# EasyEDA schematic SCH_LED stick_2021-12-25.json
TITLE: Sheet_1; REV: 1.0; Date: 2021-12-22; Sheet: 1/1; Drawn By: limchengwei; Company: Your Company
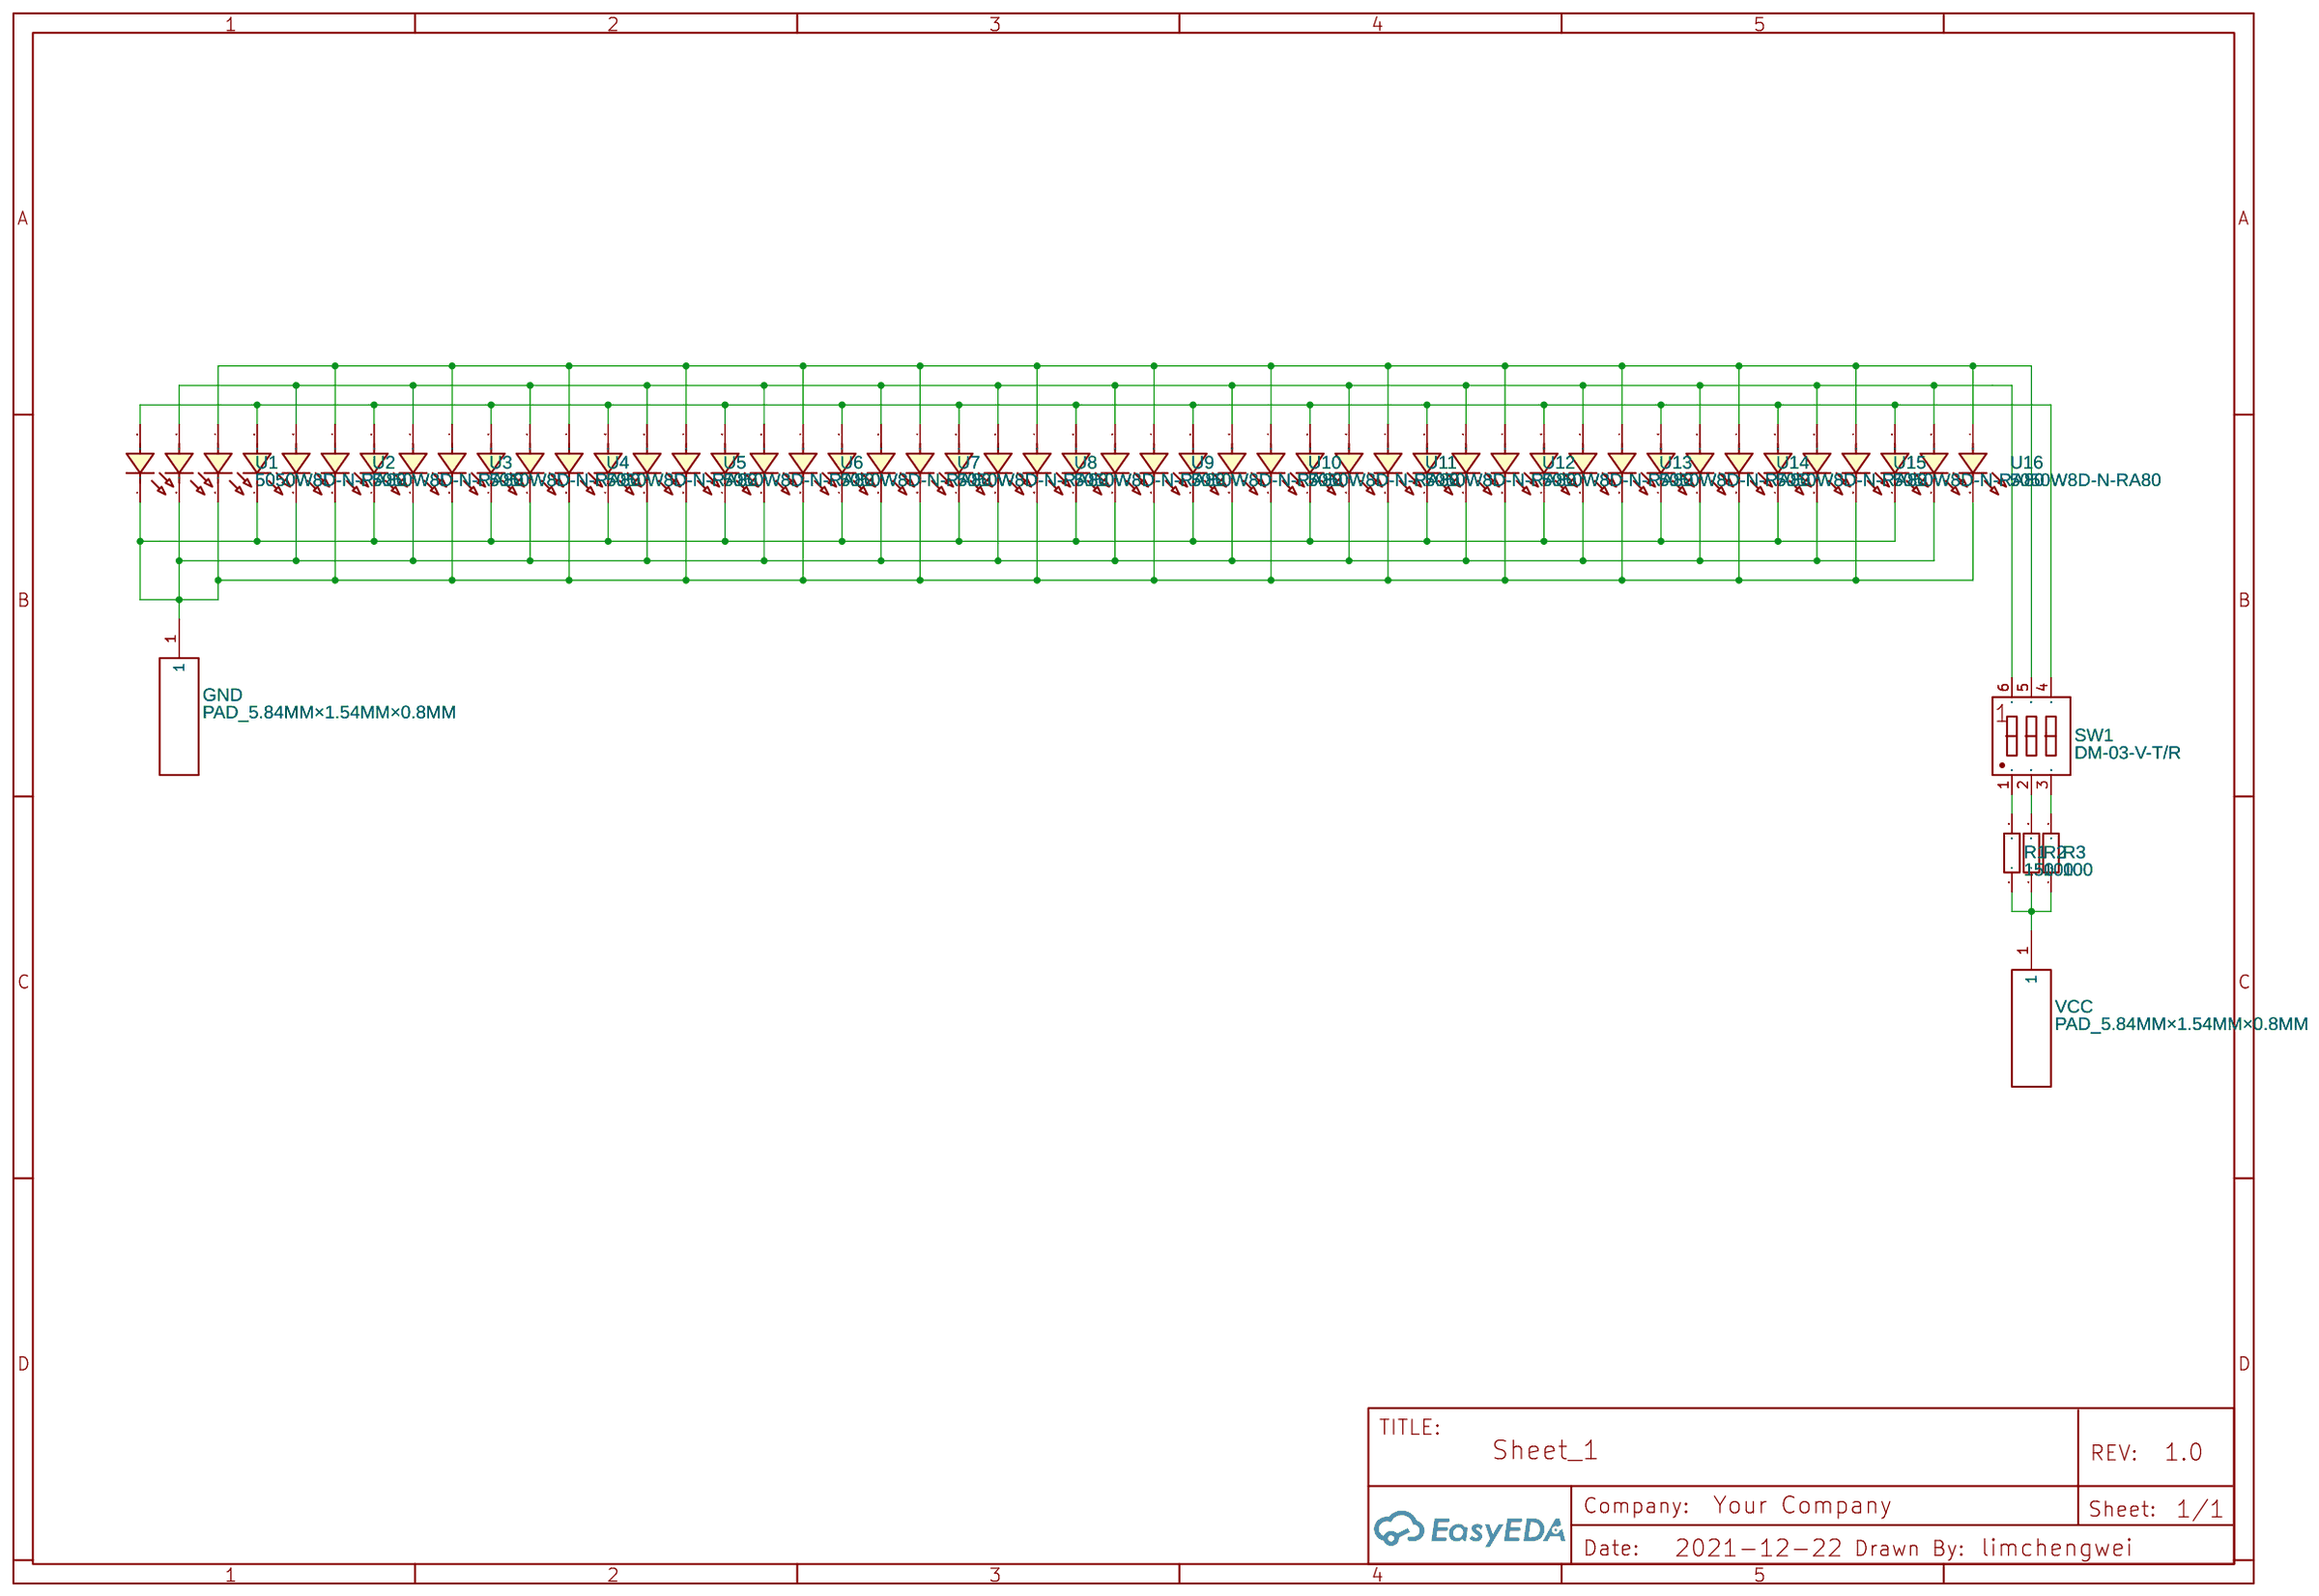
[diagram p0: schematic sheet]

## Parts
GND  PAD_5.84MM×1.54MM×0.8MM  [TESTPOINT-SMD_PAD_5.84MM-1.54MM-0.8MM]
R1  150  [R1210]
R2  100  [R1210]
R3  100  [R1210]
SW1  DM-03-V-T/R  [SW-SMD_6P-L8.6-W6.2-P2.54-LS9.8]
U1  5050W8D-N-RA80  [LED-SMD_6P-L5.0-W5.0-5050W8D-N-RA80]
U2  5050W8D-N-RA80  [LED-SMD_6P-L5.0-W5.0-5050W8D-N-RA80]
U3  5050W8D-N-RA80  [LED-SMD_6P-L5.0-W5.0-5050W8D-N-RA80]
U4  5050W8D-N-RA80  [LED-SMD_6P-L5.0-W5.0-5050W8D-N-RA80]
U5  5050W8D-N-RA80  [LED-SMD_6P-L5.0-W5.0-5050W8D-N-RA80]
U6  5050W8D-N-RA80  [LED-SMD_6P-L5.0-W5.0-5050W8D-N-RA80]
U7  5050W8D-N-RA80  [LED-SMD_6P-L5.0-W5.0-5050W8D-N-RA80]
U8  5050W8D-N-RA80  [LED-SMD_6P-L5.0-W5.0-5050W8D-N-RA80]
U9  5050W8D-N-RA80  [LED-SMD_6P-L5.0-W5.0-5050W8D-N-RA80]
U10  5050W8D-N-RA80  [LED-SMD_6P-L5.0-W5.0-5050W8D-N-RA80]
U11  5050W8D-N-RA80  [LED-SMD_6P-L5.0-W5.0-5050W8D-N-RA80]
U12  5050W8D-N-RA80  [LED-SMD_6P-L5.0-W5.0-5050W8D-N-RA80]
U13  5050W8D-N-RA80  [LED-SMD_6P-L5.0-W5.0-5050W8D-N-RA80]
U14  5050W8D-N-RA80  [LED-SMD_6P-L5.0-W5.0-5050W8D-N-RA80]
U15  5050W8D-N-RA80  [LED-SMD_6P-L5.0-W5.0-5050W8D-N-RA80]
U16  5050W8D-N-RA80  [LED-SMD_6P-L5.0-W5.0-5050W8D-N-RA80]
VCC  PAD_5.84MM×1.54MM×0.8MM  [TESTPOINT-SMD_PAD_5.84MM-1.54MM-0.8MM]

## Library data of the parts
GND VCC = PAD_5.84MM×1.54MM×0.8MM: Supplier: LCSC; Supplier Part: C9900000335; Manufacturer Part: PAD_5.84mm×1.54mm×0.8mm; JLCPCB Part Class: Extended Part; Contributor: LCSC
R1-R3 = AECR1210F220RK9: Supplier: LCSC; Supplier Part: C351971; Manufacturer: ResistorToday; Contributor: LCSC
SW1 = DM-03-V-T/R: Supplier: LCSC; Supplier Part: C501631; Manufacturer: Diptronics; Contributor: LCSC; JLCPCB Part Class: Extended Part
U1-U16 = 5050W8D-N-RA80: Supplier: LCSC; Supplier Part: C2842550; Manufacturer: null; Manufacturer Part: 5050W8D-N-Ra80; JLCPCB Part Class: Extended Part; Contributor: LCSC

## Nets
Net-(GND-1): GND.1 U1.1(K) U1.2(K) U1.3(K) U2.1(K) U2.2(K) U2.3(K) U3.1(K) U3.2(K) U3.3(K) U4.1(K) U4.2(K) U4.3(K) U5.1(K) U5.2(K) U5.3(K) U6.1(K) U6.2(K) U6.3(K) U7.1(K) U7.2(K) U7.3(K) U8.1(K) U8.2(K) U8.3(K) U9.1(K) U9.2(K) U9.3(K) U10.1(K) U10.2(K) U10.3(K) U11.1(K) U11.2(K) U11.3(K) U12.1(K) U12.2(K) U12.3(K) U13.1(K) U13.2(K) U13.3(K) U14.1(K) U14.2(K) U14.3(K) U15.1(K) U15.2(K) U15.3(K) U16.1(K) U16.2(K) U16.3(K)
Net-(R1-1): R1.1 R2.1 R3.1 VCC.1
Net-(R1-2): R1.2 SW1.1(PIN1)
Net-(R2-2): R2.2 SW1.2(PIN2)
Net-(R3-2): R3.2 SW1.3(PIN3)
Net-(SW1-4): SW1.4(PIN4) U1.6(A) U2.6(A) U3.6(A) U4.6(A) U5.6(A) U6.6(A) U7.6(A) U8.6(A) U9.6(A) U10.6(A) U11.6(A) U12.6(A) U13.6(A) U14.6(A) U15.6(A) U16.6(A)
Net-(SW1-5): SW1.5(PIN5) U1.4(A) U2.4(A) U3.4(A) U4.4(A) U5.4(A) U6.4(A) U7.4(A) U8.4(A) U9.4(A) U10.4(A) U11.4(A) U12.4(A) U13.4(A) U14.4(A) U15.4(A) U16.4(A)
Net-(SW1-6): SW1.6(PIN6) U1.5(A) U2.5(A) U3.5(A) U4.5(A) U5.5(A) U6.5(A) U7.5(A) U8.5(A) U9.5(A) U10.5(A) U11.5(A) U12.5(A) U13.5(A) U14.5(A) U15.5(A) U16.5(A)
